# Altium schematic sheet 本部自动化2003交通信号灯设计.schdoc
size 508 x 292 mm; Organization: Altium Limited; Address1: L3, 12a Rodborough Rd; Address2: Frenchs Forest; Address3: NSW; Address4: Australia 2086; SheetNumber: 1; SheetTotal: 1
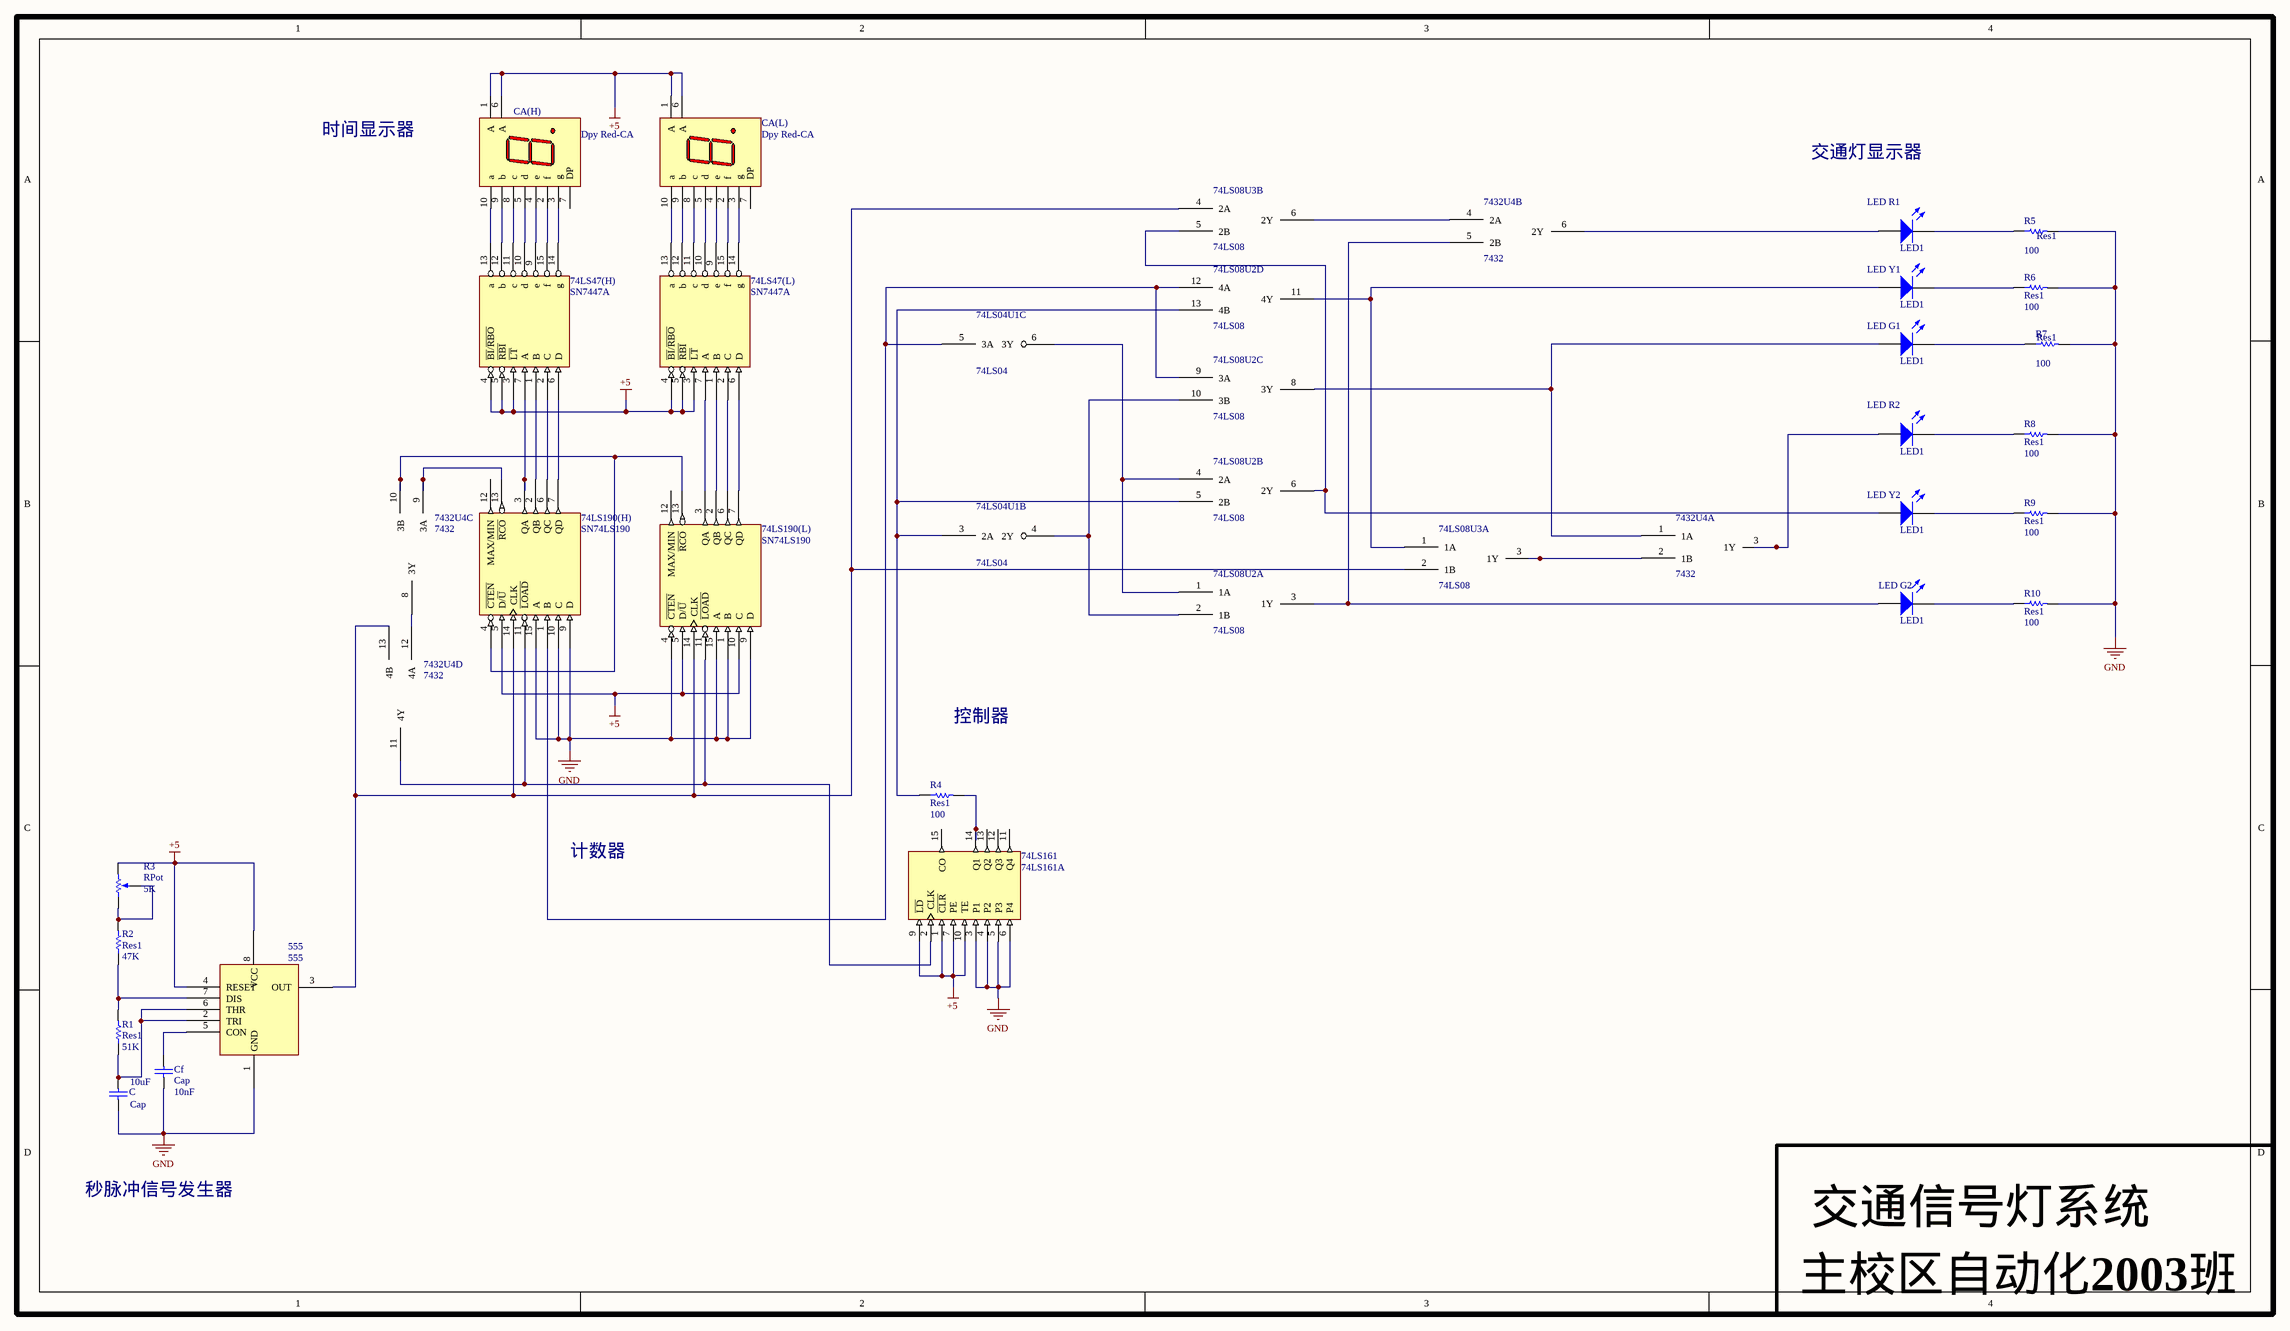
[diagram p0: 本部自动化2003交通信号灯设计.schdoc]

## Parts
74LS04U1  74LS04  [DIP14]  (parts B,C of 6)
74LS08U2  74LS08  [DIP14]  (parts A,B,C,D of 4)
74LS08U3  74LS08  [DIP14]  (parts A,B of 4)
74LS47(H)  SN7447A  [DIP16]
74LS47(L)  SN7447A  [DIP-16]
74LS161  74LS161A  [DIP-16]
74LS190(H)  SN74LS190  [DIP-16]
74LS190(L)  SN74LS190  [DIP-16]
555  555  [DIP8]
7432U4  7432  [DIP14]  (parts A,B,C,D of 4)
C  Cap  value 10uF  [RAD-0.3]
CA(H)  Dpy Red-CA  [A]
CA(L)  Dpy Red-CA  [A]
Cf  Cap  value 10nF  [RAD-0.3]
LED_G1  LED1  [LED-1]
LED_G2  LED1  [LED-1]
LED_R1  LED1  [LED-1]
LED_R2  LED1  [LED-1]
LED_Y1  LED1  [LED-1]
LED_Y2  LED1  [LED-1]
R1  Res1  value 51K  [AXIAL-0.3]
R2  Res1  value 47K  [AXIAL-0.3]
R3  RPot  value 5K  [VR5]
R4  Res1  value 100  [AXIAL-0.3]
R5  Res1  value 100  [AXIAL-0.3]
R6  Res1  value 100  [AXIAL-0.3]
R7  Res1  value 100  [AXIAL-0.3]
R8  Res1  value 100  [AXIAL-0.3]
R9  Res1  value 100  [AXIAL-0.3]
R10  Res1  value 100  [AXIAL-0.3]

## Nets
+5: 74LS47(H).3(~{LT}) 74LS47(H).4(~{BI}/~{RBO}) 74LS47(H).5(~{RBI}) 74LS47(L).3(~{LT}) 74LS47(L).4(~{BI}/~{RBO}) 74LS47(L).5(~{RBI}) 74LS161.1(~{CLR}) 74LS161.7(PE) 74LS161.9(~{LD}) 74LS161.10(TE) 74LS190(H).5(D/~{U}) 74LS190(L).5(D/~{U}) 74LS190(L).10(C) 555.4(RESET) 555.8(VCC) CA(H).1(A) CA(H).6(A) CA(L).1(A) CA(L).6(A) R3.2(BOT)
GND: 74LS47(H).8(GND) 74LS47(L).8(GND) 74LS161.3(P1) 74LS161.4(P2) 74LS161.5(P3) 74LS161.6(P4) 74LS161.8(GND) 74LS190(H).8(GND) 74LS190(H).9(D) 74LS190(H).10(C) 74LS190(H).15(A) 74LS190(L).1(B) 74LS190(L).4(~{CTEN}) 74LS190(L).8(GND) 74LS190(L).9(D) 74LS190(L).15(A) 555.1(GND) C.1 Cf.1 R5.2 R6.2 R7.2 R8.2 R9.2 R10.2
VCC: 74LS47(H).16(VCC) 74LS47(L).16(VCC) 74LS161.16(VCC) 74LS190(H).16(VCC) 74LS190(L).16(VCC)
Net74LS04U1_3: 74LS04U1.3(2A) 74LS08U2.5(2B) 74LS08U2.13(4B) R4.1
Net74LS04U1_4: 74LS04U1.4(2Y) 74LS08U2.2(1B) 74LS08U2.10(3B)
Net74LS04U1_5: 74LS04U1.5(3A) 74LS08U2.9(3A) 74LS08U2.12(4A) 74LS190(H).1(B)
Net74LS04U1_6: 74LS04U1.6(3Y) 74LS08U2.1(1A) 74LS08U2.4(2A)
Net74LS08U2_3: 74LS08U2.3(1Y) 7432U4.5(2B) LED_G2.1(A)
Net74LS08U2_6: 74LS08U2.6(2Y) 74LS08U3.5(2B) LED_Y2.1(A)
Net74LS08U2_8: 74LS08U2.8(3Y) 7432U4.1(1A) LED_G1.1(A)
Net74LS08U2_11: 74LS08U2.11(4Y) 74LS08U3.1(1A) LED_Y1.1(A)
Net74LS08U3_2: 74LS08U3.2(1B) 74LS08U3.4(2A) 74LS190(H).14(CLK) 74LS190(L).14(CLK) 555.3(OUT) 7432U4.13(4B)
Net74LS08U3_3: 74LS08U3.3(1Y) 7432U4.2(1B)
Net74LS08U3_6: 74LS08U3.6(2Y) 7432U4.4(2A)
Net74LS47(H)_1: 74LS47(H).1(B) 74LS190(H).2(QB)
Net74LS47(H)_2: 74LS47(H).2(C) 74LS190(H).6(QC)
Net74LS47(H)_6: 74LS47(H).6(D) 74LS190(H).7(QD)
Net74LS47(H)_7: 74LS47(H).7(A) 74LS190(H).3(QA)
Net74LS47(H)_9: 74LS47(H).9(e) CA(H).4(e)
Net74LS47(H)_10: 74LS47(H).10(d) CA(H).5(d)
Net74LS47(H)_11: 74LS47(H).11(c) CA(H).8(c)
Net74LS47(H)_12: 74LS47(H).12(b) CA(H).9(b)
Net74LS47(H)_13: 74LS47(H).13(a) CA(H).10(a)
Net74LS47(H)_14: 74LS47(H).14(g) CA(H).3(g)
Net74LS47(H)_15: 74LS47(H).15(f) CA(H).2(f)
Net74LS47(L)_1: 74LS47(L).1(B) 74LS190(L).2(QB)
Net74LS47(L)_2: 74LS47(L).2(C) 74LS190(L).6(QC)
Net74LS47(L)_6: 74LS47(L).6(D) 74LS190(L).7(QD)
Net74LS47(L)_7: 74LS47(L).7(A) 74LS190(L).3(QA)
Net74LS47(L)_9: 74LS47(L).9(e) CA(L).4(e)
Net74LS47(L)_10: 74LS47(L).10(d) CA(L).5(d)
Net74LS47(L)_11: 74LS47(L).11(c) CA(L).8(c)
Net74LS47(L)_12: 74LS47(L).12(b) CA(L).9(b)
Net74LS47(L)_13: 74LS47(L).13(a) CA(L).10(a)
Net74LS47(L)_14: 74LS47(L).14(g) CA(L).3(g)
Net74LS47(L)_15: 74LS47(L).15(f) CA(L).2(f)
Net74LS161_2: 74LS161.2(CLK) 74LS190(H).11(~{LOAD}) 74LS190(L).11(~{LOAD}) 7432U4.11(4Y)
Net74LS161_14: 74LS161.14(Q1) R4.2
Net74LS190(H)_4: 74LS190(H).4(~{CTEN}) 74LS190(L).13(~{RCO}) 7432U4.10(3B)
Net74LS190(H)_13: 74LS190(H).13(~{RCO}) 7432U4.9(3A)
Net555_2: 555.2(TRI) 555.6(THR) C.2 R1.1
Net555_5: 555.5(CON) Cf.2
Net555_7: 555.7(DIS) R1.2 R2.1
Net7432U4_3: 7432U4.3(1Y) LED_R2.1(A)
Net7432U4_6: 7432U4.6(2Y) LED_R1.1(A)
Net7432U4_8: 7432U4.8(3Y) 7432U4.12(4A)
NetLED_G1_2: LED_G1.2(K) R7.1
NetLED_G2_2: LED_G2.2(K) R10.1
NetLED_R1_2: LED_R1.2(K) R5.1
NetLED_R2_2: LED_R2.2(K) R8.1
NetLED_Y1_2: LED_Y1.2(K) R6.1
NetLED_Y2_2: LED_Y2.2(K) R9.1
NetR2_2: R2.2 R3.1(TOP) R3.3(TAP)

Not connected (* = marked no-connect by the designer): 74LS161 11(Q4) 12(Q3) 13(Q2) 15(CO); 74LS190(H) 12(MAX/MIN); 74LS190(L) 12(MAX/MIN); CA(H) 7(DP); CA(L) 7(DP)

## Notes on the sheet
- 时间显示器
- 交通灯显示器
- 控制器
- 计数器
- 秒脉冲信号发生器
- 交通信号灯系统
- 主校区自动化2003班
- Title
- Size:
- Date:
- File:
- C
- Number:
- Time:
- Revision:
- Sheet
- of

## Library data of the parts
74LS47(H) 74LS47(L) = SN7446A: BCD-To-SEVEN-SEGMENT DEC DRV
74LS161 = 74LS161A: Synchronous 4-Bit Binary Counter with Direct Clear
74LS190(H) 74LS190(L) = SN74LS190: SYN UP/DOWN CNT DOWN/UP MODE CONTTOL
C Cf = Cap: Capacitor; Published: 8-Jun-2000; LatestRevisionDate: 17-Jul-2002; LatestRevisionNote: Re-released for DXP Platform.; PackageReference: RAD-0.3; Publisher: Altium Limited; PackageDescription: Radial Cap, Thru-Hole; 2 Leads; 0.3 in Pin Spacing
CA(H) CA(L) = Dpy Red-CA: 7.62 mm Black Surface HER 7-Segment Display: CA, RH DP; MinimumIntensity: 360 ucd; Note: IF = 5 mA; Note: Pins 1 and 6 are redundant Anodes.; Published: 8-Jun-2000; LatestRevisionDate: 17-Dec-2003; LatestRevisionNote: Schematic revised, PCB Footprint replaced.; DatasheetVersion: 19-Feb-2002; PackageVersion: 11-Feb-2002; PackageReference: A; Publisher: Altium Limited; PackageDescription: LED, 7-Segment Display, 7.62 mm, RHD; 10 Leads; Row Space 5.08 mm; Pitch 2.54 mm; Colour: High Efficiency Red (HER); ComponentLink1Description: Manufacturer Link; ComponentLink1URL: http://www.agilent.com/
LED_G1 LED_G2 LED_R1 LED_R2 LED_Y1 LED_Y2 = LED1: Typical RED GaAs LED; Published: 8-Jun-2000; LatestRevisionDate: 08-Jul-2005; LatestRevisionNote: Mech Layer 1 removed.; PackageReference: LED-1; Publisher: Altium Limited; PackageDescription: LED; 2 Leads
R1 R2 R4-R10 = Res1: Resistor; Published: 8-Jun-2000; LatestRevisionDate: 17-Jul-2002; LatestRevisionNote: Re-released for DXP Platform.; PackageReference: AXIAL-0.3; Publisher: Altium Limited; PackageDescription: Axial Device, Thru-Hole; 2 Leads; 0.3 in Pin Spacing
R3 = RPot: Potentiometer; Sim Note: Enter the Resistance value and the set point into parameter fields.; Set Position: 0.5; Published: 8-Jun-2000; LatestRevisionDate: 17-Jul-2002; LatestRevisionNote: Re-released for DXP Platform.; PackageReference: VR5; Publisher: Altium Limited; PackageDescription: Variable Resistor, Thru-Hole; 3 Leads